# EAGLE design driverPZT_01 (EAGLE 6.4)
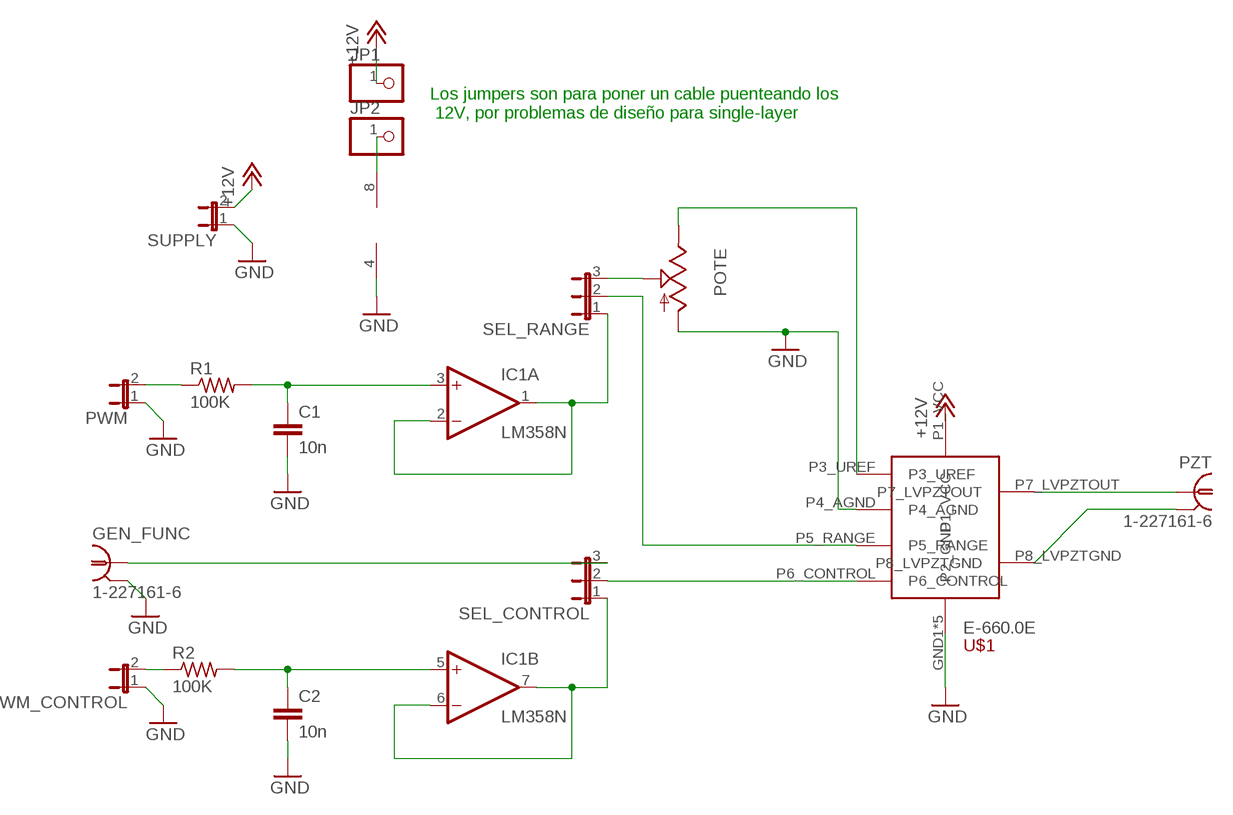
[diagram p0: schematic, sheet 1]

## Parts
C1  10n  C-EU050-075X075  [C050-075X075]
C2  10n  C-EU050-075X075  [C050-075X075]
GEN_FUNC  1-227161-6  [AMP_227161]
IC1  LM358N  [DIL08]
JP1  PINHD-1X1  [1X01]
JP2  PINHD-1X1  [1X01]
POTE  TRIM_US-B64Y  [B64Y]
PWM  JP1E  [JP1]
PWM_CONTROL  JP1E  [JP1]
PZT  1-227161-6  [AMP_227161]
R1  100K  R-US_0207/12  [0207/12]
R2  100K  R-US_0207/12  [0207/12]
SEL_CONTROL  JP2E  [JP2]
SEL_RANGE  JP2E  [JP2]
SUPPLY  JP1E  [JP1]
U$1  E-660.0E  [E-660.0E]

## Nets
+12V: JP1.1 SUPPLY.2 U$1.P1_VCC
GF: SEL_RANGE.2 U$1.P5_RANGE
GND: C1.2 C2.2 GEN_FUNC.2 IC1.4(P:V-) POTE.A PWM.1 PWM_CONTROL.1 SUPPLY.1 U$1.GND1(P2_GND) U$1.GND2(P2_GND) U$1.GND3(P2_GND) U$1.GND4(P2_GND) U$1.P2_GND U$1.P4_AGND
N$1: PWM_CONTROL.2 R2.1
N$2: C2.1 IC1.5(B:+IN) R2.2
N$3: SEL_CONTROL.2 U$1.P6_CONTROL
N$4: GEN_FUNC.1 SEL_CONTROL.3
N$5: C1.1 IC1.3(A:+IN) R1.2
N$6: IC1.1(A:OUT) IC1.2(A:-IN) SEL_RANGE.1
N$7: POTE.E U$1.P3_UREF
N$8: IC1.6(B:-IN) IC1.7(B:OUT) SEL_CONTROL.1
N$9: IC1.8(P:V+) JP2.1
POTE: POTE.S SEL_RANGE.3
PWM: PWM.2 R1.1
PZT: PZT.1 U$1.P7_LVPZTOUT
PZTGND: PZT.2 U$1.P8_LVPZTGND

## Notes on the sheet
- Los jumpers son para poner un cable puenteando los
   12V, por problemas de diseño para single-layer

## Library data of the parts
C1 C2 = rcl:C-EU: CAPACITOR, European symbol
GEN_FUNC PZT = con-coax:?227161*: JACK, RIGHT ANGLE, 50 OHM, PCB, BNC Source: amp_227161.pdf; MF: TYCO ELECTRONICS; MPN: 1-227161-6; OC_FARNELL: unknown; OC_NEWARK: 09H7854
IC1 = linear:LM358: OP AMP also LM158; LM258; LM2904 Source: http://cache.national.com/ds/LM/LM158.pdf
JP1 JP2 = pinhead:PINHD-1X1: PIN HEADER
POTE = pot:TRIM_US-: POTENTIOMETER
PWM PWM_CONTROL SUPPLY = jumper:JP1E: JUMPER
R1 R2 = resistor:R-US_: RESISTOR, American symbol
SEL_CONTROL SEL_RANGE = jumper:JP2E: JUMPER
U$1 = 00_Lolo:E-660.0E: Driver para PZT Empresa: PI Modelo: E-660.0E

## Net classes
0 default: clearance 0.355 mm

## Board
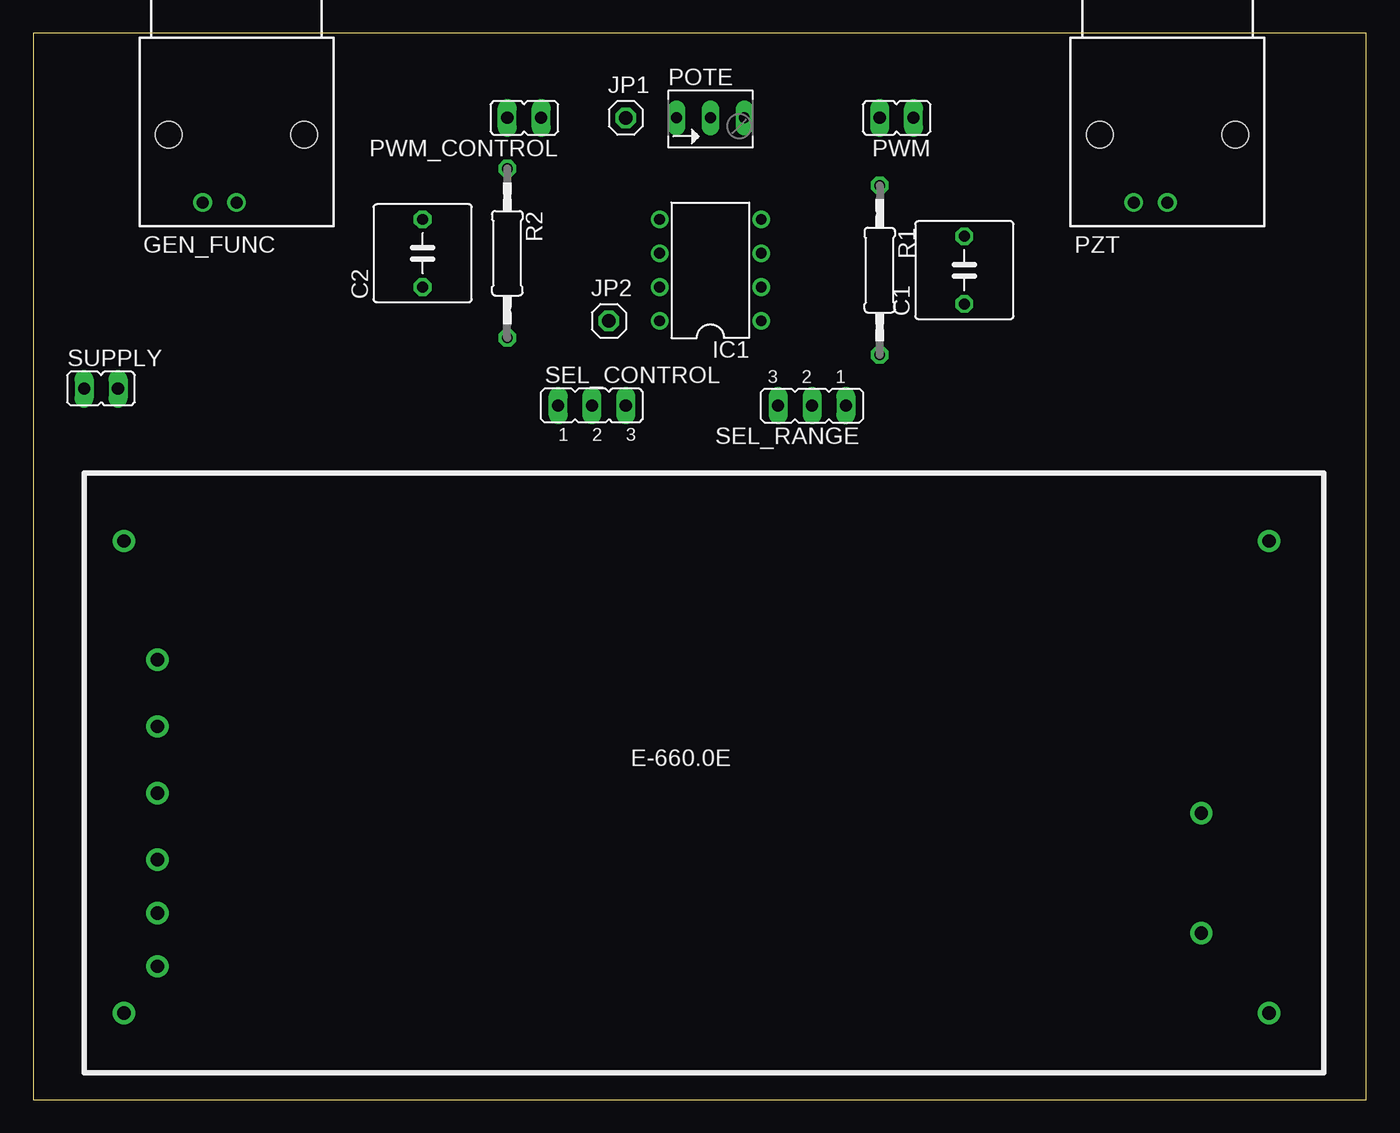
[diagram p1: board, top side]
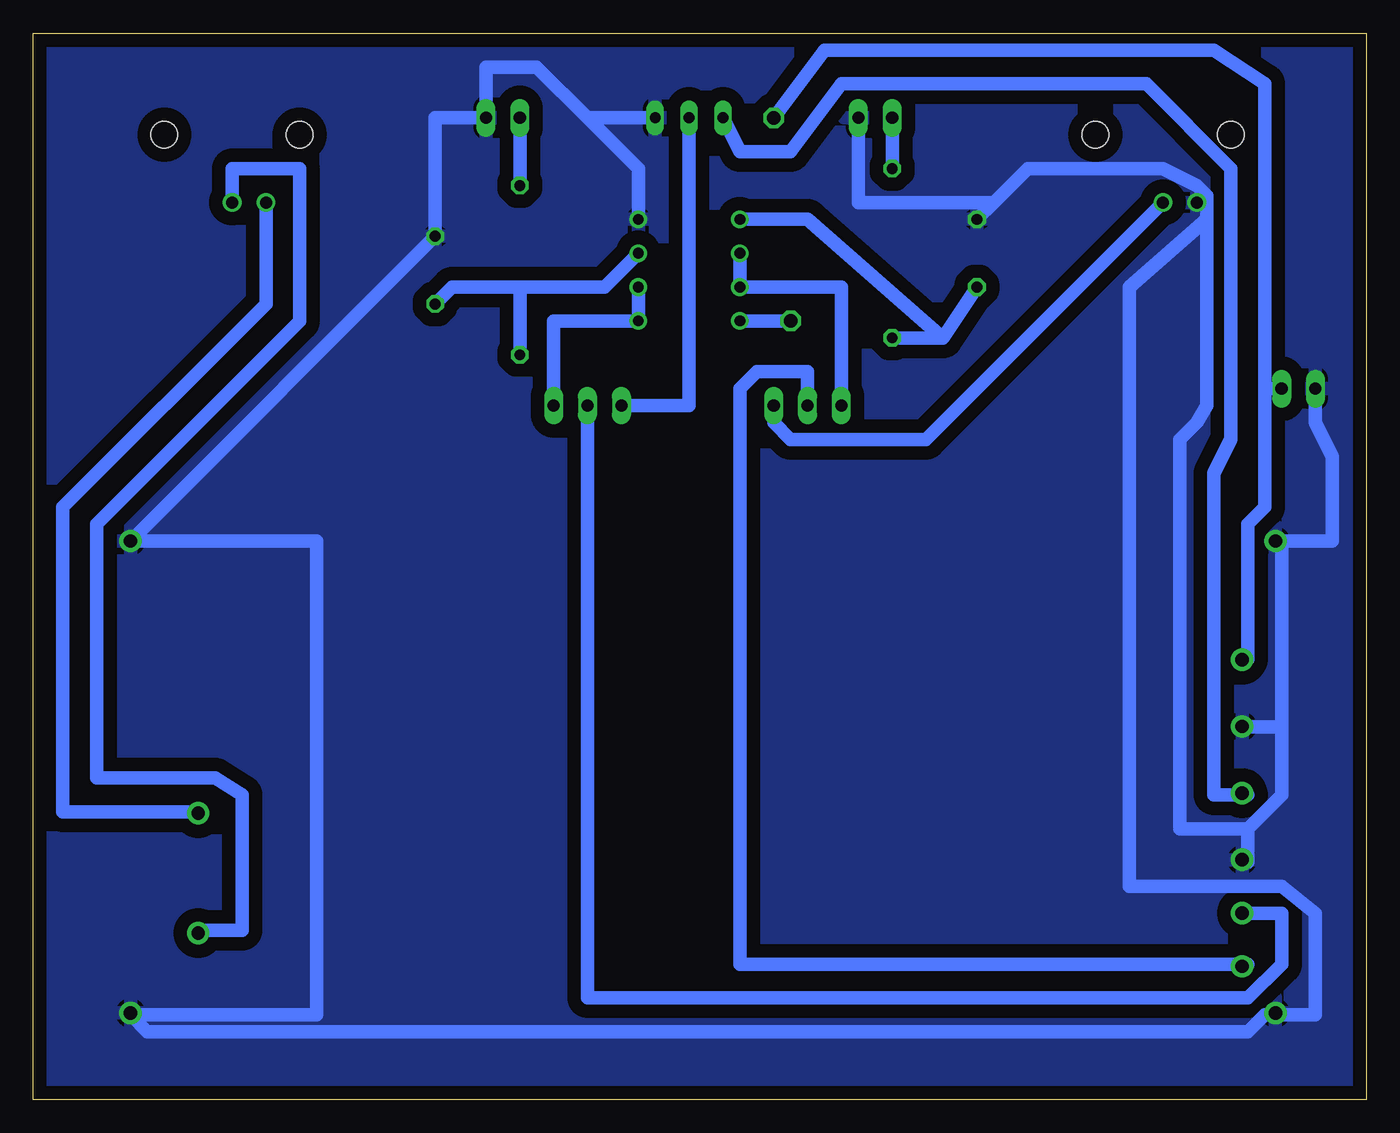
[diagram p2: board, bottom side, seen from below]

Size 100 x 80 mm. Coordinates in mm from the lower left corner, seen from the top.
Outline: 0,0 100,0 100,80 0,80 0,0
Copper layers (1*16): Top 0.035mm / dielectric 1.5mm / Bottom 0.035mm
Design rules "default *": minimum track width 40mil, minimum drill 24mil, track to track 20mil, track to pad 20mil, pad to pad 20mil, via to via 20mil, smd to smd 20mil, copper to edge 40mil, drill to drill 40mil, minimum pad ring 10mil, minimum via ring 8mil, stop-mask expansion 4mil, vias tented up to drill 0mil, thermal gap 10mil

### Footprints (pad centres in the part's own frame; a part is rotated, then mirrored left to right if it is on the bottom)
C050-075X075 = drill 0.813 octagon: 1 -2.54,0; 2 2.54,0
AMP_227161 = drill 0.9 pad 1.27: 1 0,-5.08; 2 -2.54,-5.08 | hole 2: -5.08,0; 5.08,0
DIL08 = drill 0.813 pad 1.27: 1 -3.81,-3.81; 2 -1.27,-3.81; 3 1.27,-3.81; 4 3.81,-3.81; 5 3.81,3.81; 6 1.27,3.81; 7 -1.27,3.81; 8 -3.81,3.81
1X01 = drill 1.016 octagon: 1 0,0
B64Y = drill 0.813 long: A 2.54,0; E -2.54,0; S 0,0
JP1 = drill 0.914 long: 1 0,-1.27; 2 0,1.27
0207/12 = drill 0.813 octagon: 1 -6.35,0; 2 6.35,0
JP2 = drill 0.914 long: 1 -2.54,0; 2 0,0; 3 2.54,0
E-660.0E = drill 1 pad 1.676: GND1 3,-5.08; GND2 88.9,-5.08; GND3 88.9,-40.5; GND4 3,-40.5; P1_VCC 5.5,-14; P2_GND 5.5,-19; P3_UREF 5.5,-24; P4_AGND 5.5,-29; P5_RANGE 5.5,-33; P6_CONTROL 5.5,-37; P7_LVPZTOUT 83.82,-34.5; P8_LVPZTGND 83.82,-25.5

### Placement (x,y rotation side)
C1  69.85,62.23 90 top
C2  29.21,63.5 90 top
GEN_FUNC  15.24,72.39 0 top
IC1  50.8,62.23 90 top
JP1  44.45,73.66 0 top
JP2  43.18,58.42 0 top
POTE  50.8,73.66 0 top
PWM  64.77,73.66 90 top
PWM_CONTROL  36.83,73.66 90 top
PZT  85.09,72.39 0 top
R1  63.5,62.23 270 top
R2  35.56,63.5 270 top
SEL_CONTROL  41.91,52.07 0 top
SEL_RANGE  58.42,52.07 180 top
SUPPLY  5.08,53.34 270 top
U$1  3.81,46.99 0 top

### Tracks (layer width: path | path; a pad name or v marks a point on that pad's centre or on a via)
+12V
  Bottom 1.016: 7.62,53.34 7.62,44.45 8.89,43.18 8.89,33.02 U$1.P1_VCC | JP1.1 40.64,78.74 11.43,78.74 7.62,76.2 7.62,53.34 | SUPPLY.2 7.62,53.34
GF
  Bottom 1.016: SEL_RANGE.2 58.42,7.62 8.89,7.62 6.35,10.16 6.35,13.97 8.89,13.97 U$1.P5_RANGE
GND
  Bottom 1.016: U$1.GND2 92.71,41.89 | 92.71,6.35 78.74,6.35 78.74,41.91 U$1.GND2 | U$1.GND2 C1.2 69.85,73.66 PWM.1 66.04,77.47 62.23,77.47 58.42,73.66 | 27.94,67.31 25.4,69.85 15.24,69.85 12.7,68.58 11.94,67.82 11.94,67.31 | 27.94,67.31 C2.2 | PWM_CONTROL.1 38.1,67.31 27.94,67.31 | 92.71,6.35 91.44,5.08 8.89,5.08 7.62,6.35 U$1.GND4 6.35,6.35 3.81,6.35 3.81,13.97 6.35,16 17.78,16 17.78,60.96 11.94,66.04 | 92.71,6.35 U$1.GND3 | 58.42,73.66 54.61,69.85 IC1.4 | POTE.A 58.42,73.66 | 8.89,20.32 8.89,17.78 U$1.P4_AGND | 8.89,20.32 6.35,22.86 6.35,27.94 | 6.35,27.94 8.89,27.94 U$1.P2_GND | SUPPLY.1 3.81,50.8 2.54,48.26 2.54,41.91 6.35,41.91 | 6.35,41.91 6.35,27.94 | 6.35,41.91 U$1.GND1 | 8.89,20.32 13.97,20.32 13.97,49.53 12.7,50.8 11.94,52.07 11.94,66.04 | GEN_FUNC.2 11.94,67.31 | 11.94,67.31 11.94,66.04
  pour Bottom (isolate 1.016): 0,80.01 100.33,80.01 100.33,0 0,0
N$1
  Bottom 1.016: PWM_CONTROL.2 R2.1
N$2
  Bottom 1.016: 31.75,57.15 C2.1 | R2.2 31.75,57.15 | IC1.5 41.91,66.04 31.75,57.15
N$3
  Bottom 1.016: SEL_CONTROL.2 41.91,54.61 45.72,54.61 46.99,53.34 46.99,10.16 8.89,10.16 U$1.P6_CONTROL
N$4
  Bottom 1.016: GEN_FUNC.1 33.02,49.53 43.18,49.53 44.45,50.8 SEL_CONTROL.3
N$5
  Bottom 1.016: IC1.3 57.15,60.96 63.5,60.96 | 63.5,60.96 68.58,60.96 C1.1 | 63.5,60.96 R1.2
N$6
  Bottom 1.016: IC1.2 IC1.1 60.96,58.42 SEL_RANGE.1
N$7
  Bottom 1.016: POTE.E 46.99,71.12 43.18,71.12 39.37,76.2 16.51,76.2 10.16,69.85 10.16,49.53 11.43,46.99 11.43,22.86 8.89,22.86 U$1.P3_UREF
N$8
  Bottom 1.016: IC1.6 IC1.7 39.37,60.96 SEL_CONTROL.1
N$9
  Bottom 1.016: JP2.1 IC1.8
POTE
  Bottom 1.016: POTE.S 50.8,52.07 SEL_RANGE.3
PWM
  Bottom 1.016: PWM.2 R1.1
PZT
  Bottom 1.016: PZT.1 85.09,69.85 80.01,69.85 80.01,58.42 95.25,43.18 95.25,24.13 86.36,24.13 84.33,22.86 84.33,12.7 87.63,12.7 U$1.P7_LVPZTOUT
PZTGND
  Bottom 1.016: PZT.2 82.55,59.69 97.79,44.45 97.79,21.59 87.63,21.59 U$1.P8_LVPZTGND